# Altium schematic sheet LOA,LCD,TEMP.SchDoc
size A1
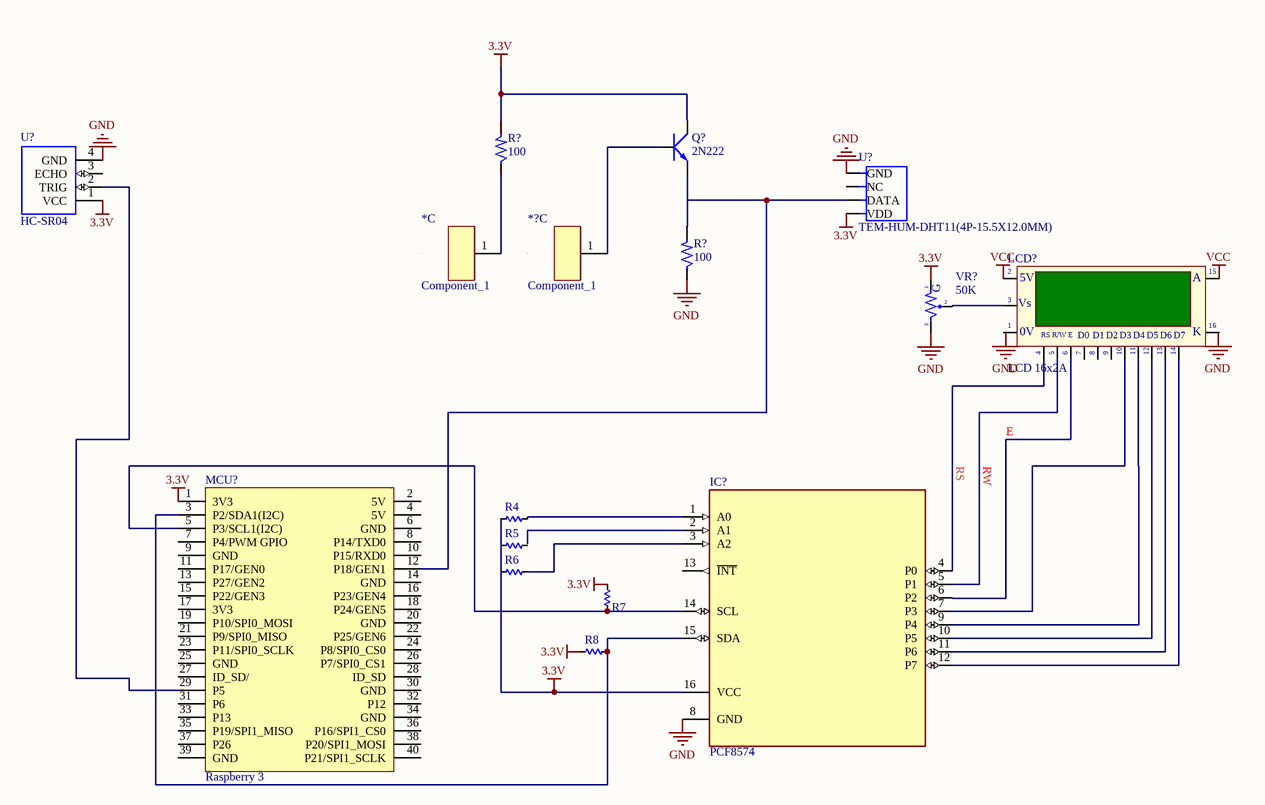
[diagram p0: LOA,LCD,TEMP.SchDoc]

## Parts
(Parts that share a designator on the sheet are numbered #1, #2 ... from top to bottom, then left to right.)
*  Component_1  (part C of 3)
*?  Component_1  (part C of 3)
IC?  PCF8574  [SOIC16W]
LCD?  LCD 16x2A  [JP16-C1T]
MCU?  Raspberry 3  [RASPBERRY PI 3]
Q?  2N222  [TO92-123]
R4  Res  [RES-1/2W]  (value not drawn)
R5  Res  [RES-1/2W]  (value not drawn)
R6  Res  [RES-1/2W]  (value not drawn)
R7  Res  [RES-1/2W]  (value not drawn)
R8  Res  [RES-1/2W]  (value not drawn)
R?#1  100  [SM-RES-1206]
R?#2  100  [SM-RES-1206]
U?#1  HC-SR04  [XCVR_HC-SR04]
U?#2  TEM-HUM-DHT11(4P-15.5X12.0MM)  [SNR4-2.54-15.5X12.0X5.5MM]
VR?  50K  [VR-S1]

## Nets
3.3V: IC?.16(VCC) MCU?.1(3V3) Q?.3(C) R4.2 R5.2 R6.2 R7.1 R8.2 R?#1.2 U?#1.1(VCC) U?#2.1(VDD) VR?.1
GND: IC?.8(GND) R?#2.1 U?#1.4(GND) U?#2.4(GND) VR?.3
VCC: LCD?.2(VDD) LCD?.15(A)
NetIC?_1: IC?.1(A0) R4.1
NetIC?_3: IC?.3(A2) R6.1
NetIC?_4: IC?.4(P0) LCD?.4(RS)
NetIC?_5: IC?.5(P1) LCD?.5(R/~{W})
NetIC?_6: IC?.6(P2) LCD?.6(~{EN})
NetIC?_7: IC?.7(P3) LCD?.10(D3)
NetIC?_9: IC?.9(P4) LCD?.11(D4)
NetIC?_10: IC?.10(P5) LCD?.12(D5)
NetIC?_11: IC?.11(P6) LCD?.13(D6)
NetIC?_12: IC?.12(P7) LCD?.14(D7)
NetIC?_14: IC?.14(SCL) MCU?.5(P3/SCL1(I2C)) R7.2
NetIC?_15: IC?.15(SDA) MCU?.3(P2/SDA1(I2C)) R8.1
NetLCD?_3: LCD?.3(VEE) VR?.2
NetMCU?_12: MCU?.12(P18/GEN1) Q?.1(E) R?#2.2 U?#2.2(DATA)
NetMCU?_29: MCU?.29(P5) U?#1.2(TRIG)

Not connected (* = marked no-connect by the designer): * 1; *? 1; IC? 2(A1) 13(~{INT}); LCD? 1(GND) 7(D0) 8(D1) 9(D2) 16(K); MCU? 2(5V) 4(5V) 6(GND) 7(P4/PWM_GPIO) 8(P14/TXD0) 9(GND) 10(P15/RXD0) 11(P17/GEN0) 13(P27/GEN2) 14(GND) 15(P22/GEN3) 16(P23/GEN4) 17(3V3) 18(P24/GEN5) 19(P10/SPI0_MOSI) 20(GND) 21(P9/SPI0_MISO) 22(P25/GEN6) 23(P11/SPI0_SCLK) 24(P8/SPI0_CS0) 25(GND) 26(P7/SPI0_CS1) 27(ID_SD/) 28(ID_SD) 30(GND) 31(P6) 32(P12) 33(P13) 34(GND) 35(P19/SPI1_MISO) 36(P16/SPI1_CS0) 37(P26) 38(P20/SPI1_MOSI) 39(GND) 40(P21/SPI1_SCLK); Q? 2(B); R5 1; R?#1 1; U?#1 3(ECHO); U?#2 3(NC)

## Notes on the sheet
- (near IC?) RS
- RW
- E
- Labels drawn without touching a wire or pin: GND
- (in symbol LCD16x2A) 5V; Vs; |; 0V; R/W; E
- (in symbol VR-S) G

## Library data of the parts
IC? = PCF8574: I/O Expander 8 IÂ²C 100 kHz 20-VQFN (3.5x4.5); MF: Texas Instruments; Package: VFQFN-16 Texas Instruments; Price: None; Value: *; SnapEDA_Link: https://www.snapeda.com/parts/PCF8574/Texas+Instruments/view-part/?ref=snap; MP: PCF8574; Availability: Not in stock; Check_prices: https://www.snapeda.com/parts/PCF8574/Texas+Instruments/view-part/?ref=eda
LCD? = LCD16x2A: LCD dipslay 16 char, 2 line; Value: LCD16x2A
MCU? = Raspi 3
Q? = 2N222: NPN 600mW, ECB; Value: C1815
R4-R8 = Res: Manufacturer: Generic Components; Class: Passive; SubClass: R; Published: 08/06/2000; Publisher: Altium Hobart Technology Centre
R?#1 R?#2 = R: Resistor 1/4W; Value: R1/4W - 1K
U?#1 = HC-SR04: Ultrasonic Sensor Module; Availability: Unavailable; MP: HC-SR04; Value: *; Price: None; Package: None
U?#2 = TEM-HUM-DHT11(4P-15.5X12.0MM): Servo AC 100 ~ 120VAC Supply 10A 120V Load; MP: DHT11; MF: Panasonic Industrial Automation Sales; Package: None; SnapEDA_Link: https://www.snapeda.com/parts/DHT11/Panasonic/view-part/6618018/?ref=snap; Check_prices: https://www.snapeda.com/parts/DHT11/Panasonic/view-part/6618018/?ref=eda; Availability: In Stock; Value: *; Price: None; Purchase-URL: https://pricing.snapeda.com/search/part/DHT11/?ref=eda
VR? = VR-S: Var Resistor; Value: Volume 50k